# EAGLE design schm (EAGLE 9.6.2)
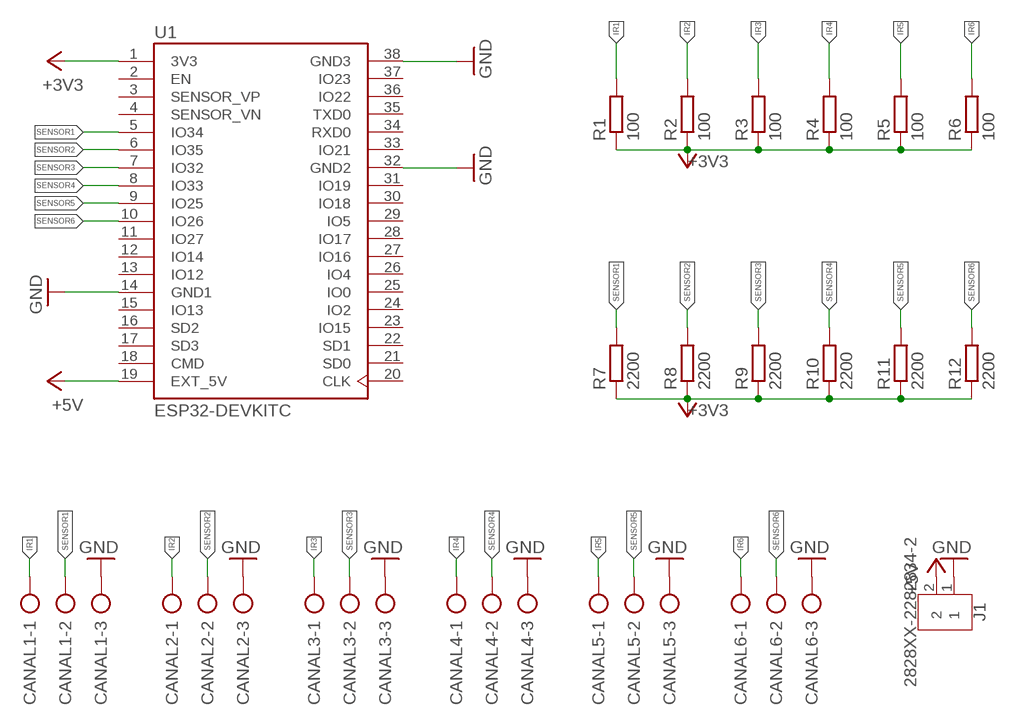
[diagram p0: schematic, sheet 1]

## Parts
CANAL1  AK300/3  [AK300/3]
CANAL2  AK300/3  [AK300/3]
CANAL3  AK300/3  [AK300/3]
CANAL4  AK300/3  [AK300/3]
CANAL5  AK300/3  [AK300/3]
CANAL6  AK300/3  [AK300/3]
J1  2828XX-2282834-2  [TERMBLK_254-2N]
R1  100  R-EU_0207/10  [0207/10]
R2  100  R-EU_0207/10  [0207/10]
R3  100  R-EU_0207/10  [0207/10]
R4  100  R-EU_0207/10  [0207/10]
R5  100  R-EU_0207/10  [0207/10]
R6  100  R-EU_0207/10  [0207/10]
R7  2200  R-EU_0207/10  [0207/10]
R8  2200  R-EU_0207/10  [0207/10]
R9  2200  R-EU_0207/10  [0207/10]
R10  2200  R-EU_0207/10  [0207/10]
R11  2200  R-EU_0207/10  [0207/10]
R12  2200  R-EU_0207/10  [0207/10]
U1  ESP32-DEVKITC  [MODULE_ESP32-DEVKITC]

## Nets
+3V3: R1.1 R2.1 R3.1 R4.1 R5.1 R6.1 R7.1 R8.1 R9.1 R10.1 R11.1 R12.1 U1.1(3V3)
+5V: J1.2 U1.19(EXT_5V)
GND: CANAL1.3 CANAL2.3 CANAL3.3 CANAL4.3 CANAL5.3 CANAL6.3 J1.1 U1.14(GND1) U1.32(GND2) U1.38(GND3)
IR1: CANAL1.1 R1.2
IR2: CANAL2.1 R2.2
IR3: CANAL3.1 R3.2
IR4: CANAL4.1 R4.2
IR5: CANAL5.1 R5.2
IR6: CANAL6.1 R6.2
SENSOR1: CANAL1.2 R7.2 U1.5(IO34)
SENSOR2: CANAL2.2 R8.2 U1.6(IO35)
SENSOR3: CANAL3.2 R9.2 U1.7(IO32)
SENSOR4: CANAL4.2 R10.2 U1.8(IO33)
SENSOR5: CANAL5.2 R11.2 U1.9(IO25)
SENSOR6: CANAL6.2 R12.2 U1.10(IO26)
Unconnected: U1.2(EN) U1.3(SENSOR_VP) U1.4(SENSOR_VN) U1.11(IO27) U1.12(IO14) U1.13(IO12) U1.15(IO13) U1.16(SD2) U1.17(SD3) U1.18(CMD) U1.20(CLK) U1.21(SD0) U1.22(SD1) U1.23(IO15) U1.24(IO2) U1.25(IO0) U1.26(IO4) U1.27(IO16) U1.28(IO17) U1.29(IO5) U1.30(IO18) U1.31(IO19) U1.33(IO21) U1.34(RXD0) U1.35(TXD0) U1.36(IO22) U1.37(IO23)

## Library data of the parts
CANAL1-CANAL6 = con-ptr500:AK300/3: CONNECTOR; OC_FARNELL: unknown; OC_NEWARK: unknown
J1 = Connector:2828XX-2: 2 Position Wire to Board Terminal Block Horizontal with Board Datasheet <https://www.te.com.cn/commerce/DocumentDelivery/DDEController?Action=showdoc&DocId=Catalog+Section%7F1308389_EUROSTYLE_TERMINAL_BLOCKS%7F0607%7Fpdf%7FEnglish%7FENG_CS_1308389_EUROSTYLE_TERMINAL_BLOCKS_0607.pdf%7F2-282837-5>; CATEGORY: Fixed Terminal Blocks; DATASHEET: https://www.te.com/usa-en/product-282834-2.datasheet.pdf; DESCRIPTION: 2 Position Wire to Board Terminal Block Horizontal with Board 0.100" (2.54mm) Through Hole; MANUFACTURER: TE Connectivity AMP Connectors; MPN: 282834-2; OPERATING_TEMPERATURE: -40°C ~ 105°C; PACKAGE_SIZE: NA; PACKAGE_TYPE: THT; PART_STATUS: ACTIVE; PITCH: 0.100" (2.54mm); ROHS: COMPLIANT; SERIES: Buchanan; SUBCATEGORY: Terminal Blocks; TYPE: Through Hole Screw - Rising Cage Clamp Side wire entry Horizontal with Board
R1-R12 = rcl:R-EU_: RESISTOR, European symbol; SPICEPREFIX: R
U1 = ESP32-DEVKITC:ESP32-DEVKITC: Check availability <https://pricing.snapeda.com/parts/ESP32-DEVKITC-32D-F/Espressif%20Systems/view-part?ref=eda>; AVAILABILITY: In Stock; CHECK_PRICES: https://www.snapeda.com/parts/ESP32-DEVKITC-32D-F/Espressif+Systems/view-part/?ref=eda; DESCRIPTION: Transceiver; 802.11 b/g/n (Wi-Fi, WiFi, WLAN), Bluetooth® Smart Ready 4.x Dual Mode; MF: Espressif Systems; MP: ESP32-DEVKITC-32D-F; PACKAGE: None; PRICE: None; SNAPEDA_LINK: https://www.snapeda.com/parts/ESP32-DEVKITC-32D-F/Espressif+Systems/view-part/?ref=snap

## Board
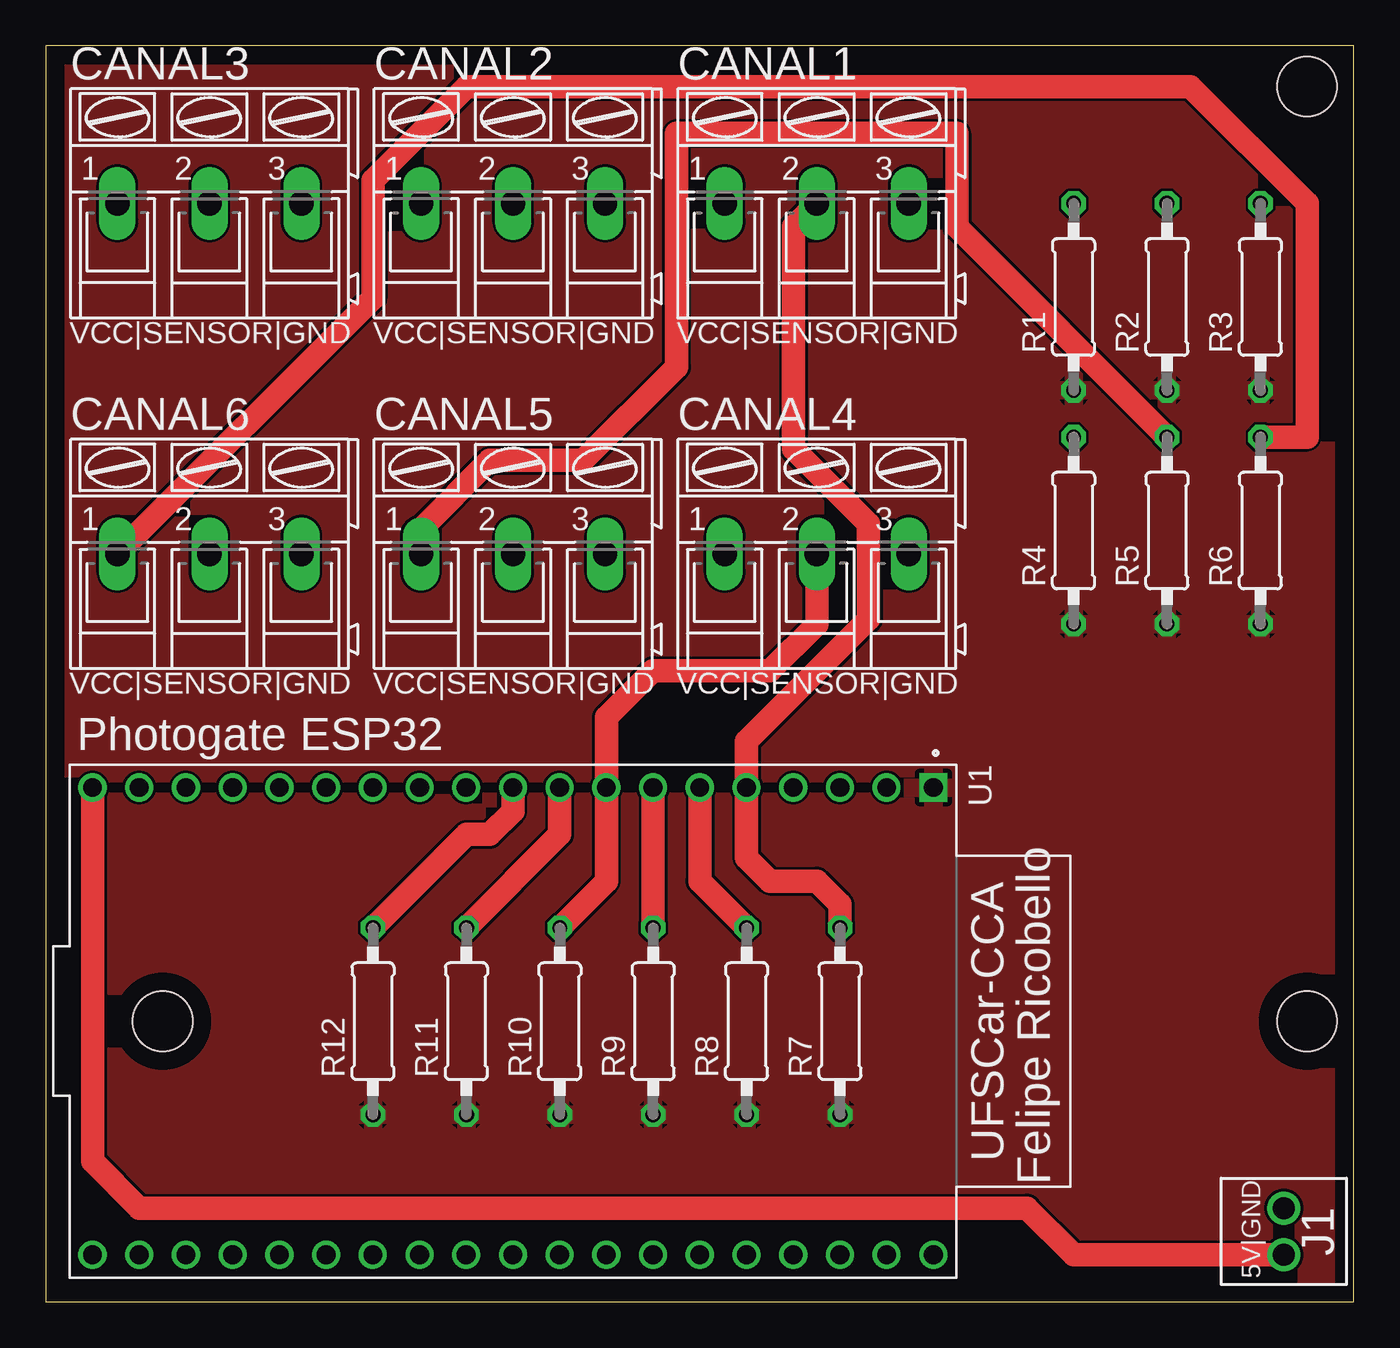
[diagram p1: board, top side]
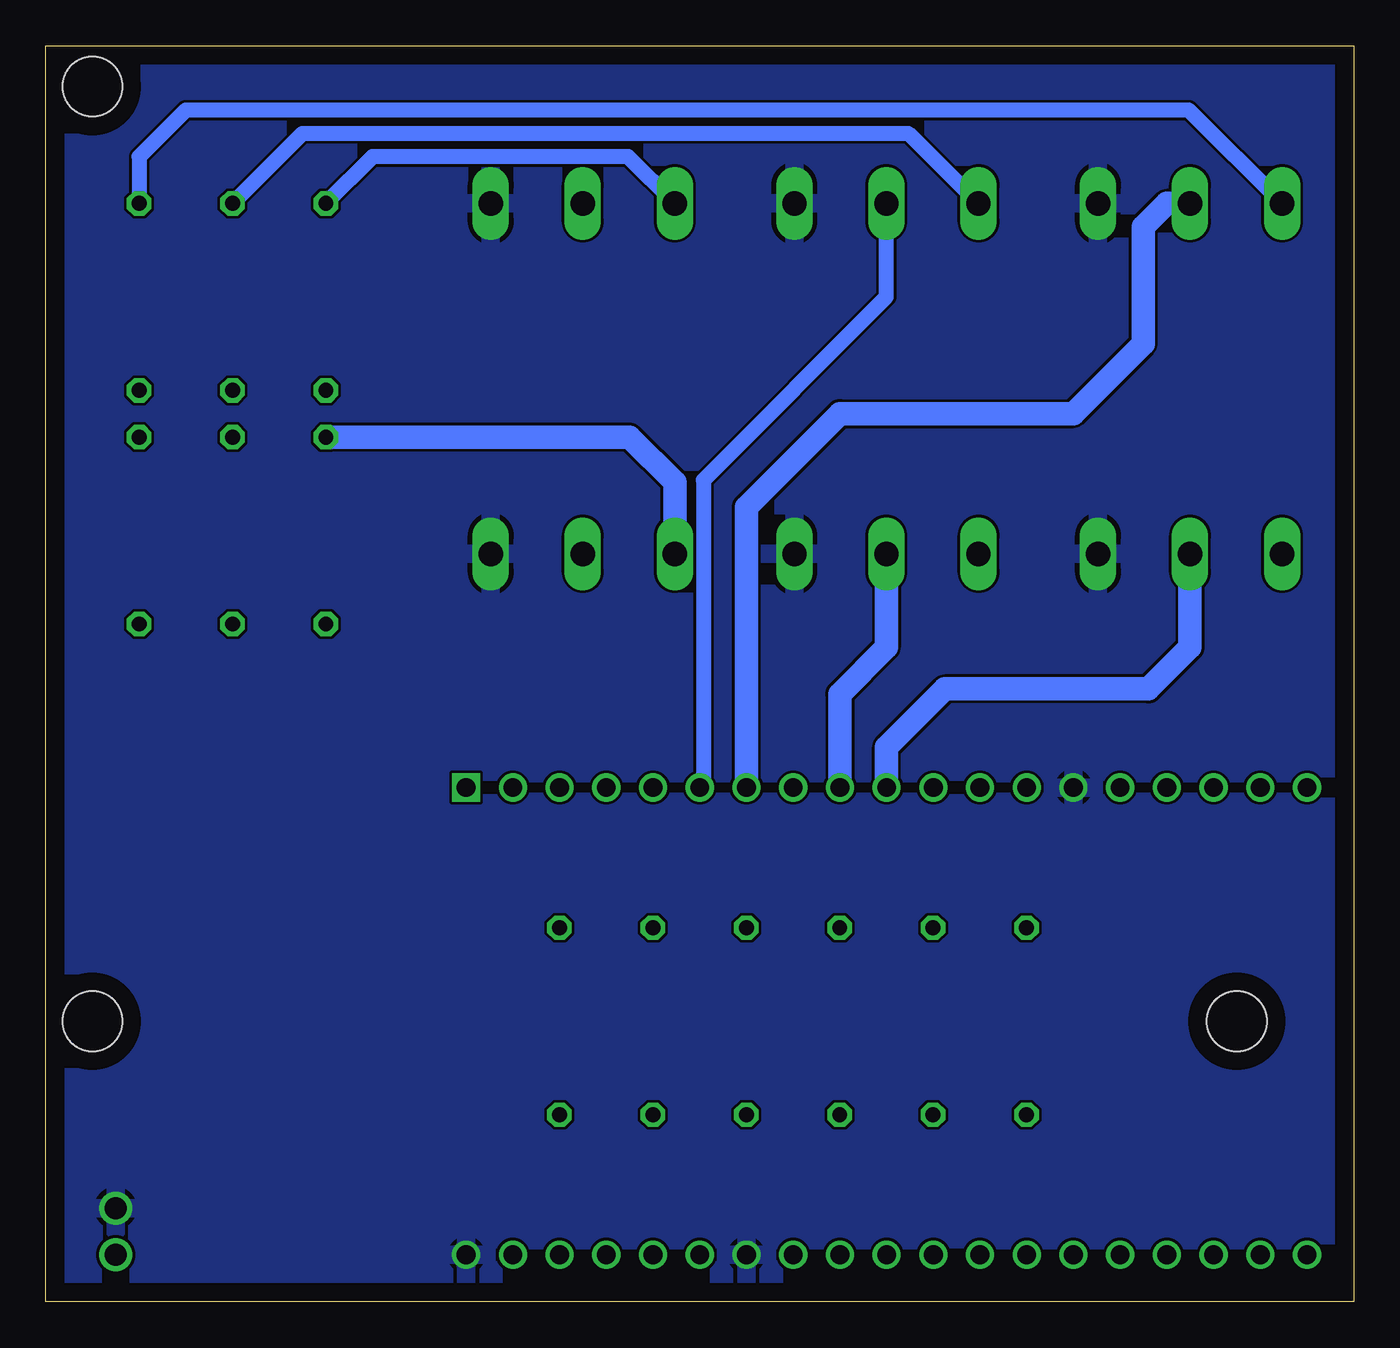
[diagram p2: board, bottom side, seen from below]

Size 71.1 x 68.25 mm. Coordinates in mm from the lower left corner, seen from the top.
Outline: 0,0 71.1,0 71.1,68.25 0,68.25 0,0
Copper layers (1*16): Top 0.035mm / dielectric 1.5mm / Bottom 0.035mm
Design rules "default *": minimum track width 18mil, minimum drill 0.35mm, track to track 6mil, track to pad 6mil, pad to pad 6mil, via to via 6mil, smd to smd 6mil, copper to edge 40mil, drill to drill 6mil, minimum pad ring 10mil, minimum via ring 8mil, stop-mask expansion 4mil, vias tented up to drill 0mil, thermal gap 10mil
Holes 3.25 mm at 68.58,66.04 6.35,15.24 68.58,15.24

### Footprints (pad centres in the part's own frame; a part is rotated, then mirrored left to right if it is on the bottom)
AK300/3 = drill 1.321 long: 1 -5.004,0; 2 0,0; 3 5.004,0
TERMBLK_254-2N = drill 1.2: 1 0,0; 2 2.54,0
0207/10 = drill 0.813 octagon: 1 -5.08,0; 2 5.08,0
MODULE_ESP32-DEVKITC = drill 1.02 square: 1 -12.7,22.85 | drill 1.02: 2 -12.7,20.31; 3 -12.7,17.77; 4 -12.7,15.23; 5 -12.7,12.69; 6 -12.7,10.15; 7 -12.7,7.61; 8 -12.7,5.07; 9 -12.7,2.53; 10 -12.7,-0.01; 11 -12.7,-2.55; 12 -12.7,-5.09; 13 -12.7,-7.63; 14 -12.7,-10.17; 15 -12.7,-12.71; 16 -12.7,-15.25; 17 -12.7,-17.79; 18 -12.7,-20.33; 19 -12.7,-22.87; 20 12.7,-22.87; 21 12.7,-20.33; 22 12.7,-17.79; 23 12.7,-15.25; 24 12.7,-12.71; 25 12.7,-10.17; 26 12.7,-7.63; 27 12.7,-5.09; 28 12.7,-2.55; 29 12.7,-0.01; 30 12.7,2.53; 31 12.7,5.07; 32 12.7,7.61; 33 12.7,10.15; 34 12.7,12.69; 35 12.7,15.23; 36 12.7,17.77; 37 12.7,20.31; 38 12.7,22.85

### Placement (x,y rotation side)
CANAL1  41.91,59.69 0 top
CANAL2  25.4,59.69 0 top
CANAL3  8.89,59.69 0 top
CANAL4  41.91,40.64 0 top
CANAL5  25.4,40.64 0 top
CANAL6  8.89,40.64 0 top
J1  67.31,5.08 270 top
R1  55.88,54.61 90 top
R2  60.96,54.61 90 top
R3  66.04,54.61 90 top
R4  55.88,41.91 90 top
R5  60.96,41.91 90 top
R6  66.04,41.91 90 top
R7  43.18,15.24 90 top
R8  38.1,15.24 90 top
R9  33.02,15.24 90 top
R10  27.94,15.24 90 top
R11  22.86,15.24 90 top
R12  17.78,15.24 90 top
U1  25.4,15.24 270 top

### Tracks (layer width: path | path; a pad name or v marks a point on that pad's centre or on a via)
+3V3
  pour Top: 0,68.58 71.12,68.58 71.12,0 0,0
+5V
  Top 1.27: U1.19 2.54,7.62 5.08,5.08 53.34,5.08 55.88,2.54 J1.2
GND
  pour Bottom: 0,68.58 71.12,68.58 71.12,0 0,0
IR1
  Bottom 0.813: CANAL1.1 39.45,62.23 53.34,62.23 R1.2
IR2
  Bottom 0.813: R2.2 57.15,63.5 24.21,63.5 CANAL2.1
IR3
  Bottom 0.813: CANAL3.1 8.97,64.77 63.5,64.77 66.04,62.23 R3.2
IR4
  Bottom 1.27: CANAL4.1 36.91,44.53 39.37,46.99 R4.2
IR5
  Top 1.27: CANAL5.1 20.4,41.99 24.13,45.72 29.21,45.72 34.29,50.8 34.29,63.5 49.53,63.5 49.53,58.42 R5.2
IR6
  Top 1.27: R6.2 68.58,46.99 68.58,59.69 62.23,66.04 22.86,66.04 17.78,60.96 17.78,54.53 CANAL6.1
SENSOR1
  Top 1.27: U1.5 | U1.5 38.1,30.47 44.73,37.1 44.73,42.27 40.64,46.36 40.64,58.42 CANAL1.2 | U1.5 38.1,24.13 39.37,22.86 41.91,22.86 43.18,21.59 R7.2
SENSOR2
  Top 1.27: U1.6 35.56,22.86 R8.2
  Bottom 0.813: U1.6 35.36,28.13 35.36,44.65 25.4,54.61 CANAL2.2
SENSOR3
  Top 1.27: U1.7 R9.2
  Bottom 1.27: U1.7 33.01,43.19 27.94,48.26 15.24,48.26 11.43,52.07 11.43,58.42 10.16,59.69 CANAL3.2
SENSOR4
  Top 1.27: R10.2 30.47,22.85 U1.8 30.48,31.75 33.02,34.29 39.37,34.29 41.91,36.83 CANAL4.2
SENSOR5
  Top 1.27: U1.9 27.93,25.39 R11.2
  Bottom 0.813: U1.9
  Bottom 1.27: CANAL5.2 25.4,35.56 27.94,33.02 U1.9
SENSOR6
  Top 1.27: R12.2 22.86,25.4 24.13,25.4 25.39,26.66 U1.10
  Bottom 1.27: CANAL6.2 8.89,35.56 11.15,33.3 22.22,33.3 25.39,30.14 U1.10

### Text on the board
tNames: VCC|SENSOR|GND | VCC|SENSOR|GND | VCC|SENSOR|GND | VCC|SENSOR|GND | VCC|SENSOR|GND | VCC|SENSOR|GND | Photogate ESP32 | UFSCar-CCA | Felipe Ricobello | 5V|GND